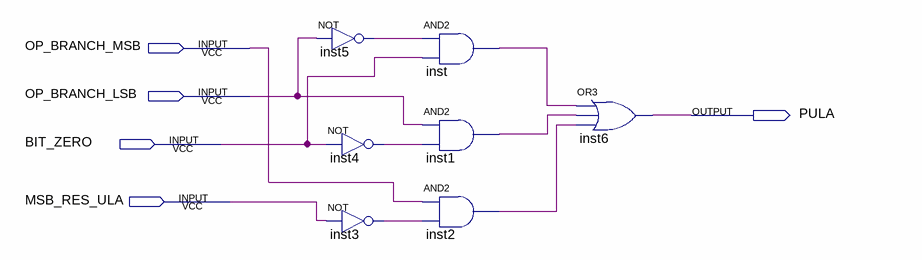
[diagram p0: schematic sheet]
// Quartus schematic BEQ_BNE_BGEZ.bdf as structural Verilog: 7 symbols, 5 pins
module BEQ_BNE_BGEZ (
  input  OP_BRANCH_MSB,
  input  OP_BRANCH_LSB,
  input  BIT_ZERO,
  input  MSB_RES_ULA,
  output PULA
);

  wire inst1_out, inst2_out, inst3_out, inst4_out, inst5_out, inst_out;

  not inst5 (inst5_out, OP_BRANCH_LSB);
  not inst4 (inst4_out, BIT_ZERO);
  not inst3 (inst3_out, MSB_RES_ULA);
  and inst (inst_out, inst5_out, BIT_ZERO);
  and inst1 (inst1_out, OP_BRANCH_LSB, inst4_out);
  and inst2 (inst2_out, OP_BRANCH_MSB, inst3_out);
  or inst6 (PULA, inst_out, inst1_out, inst2_out);
endmodule
